# Altium project galil-router-hw.PrjPCB
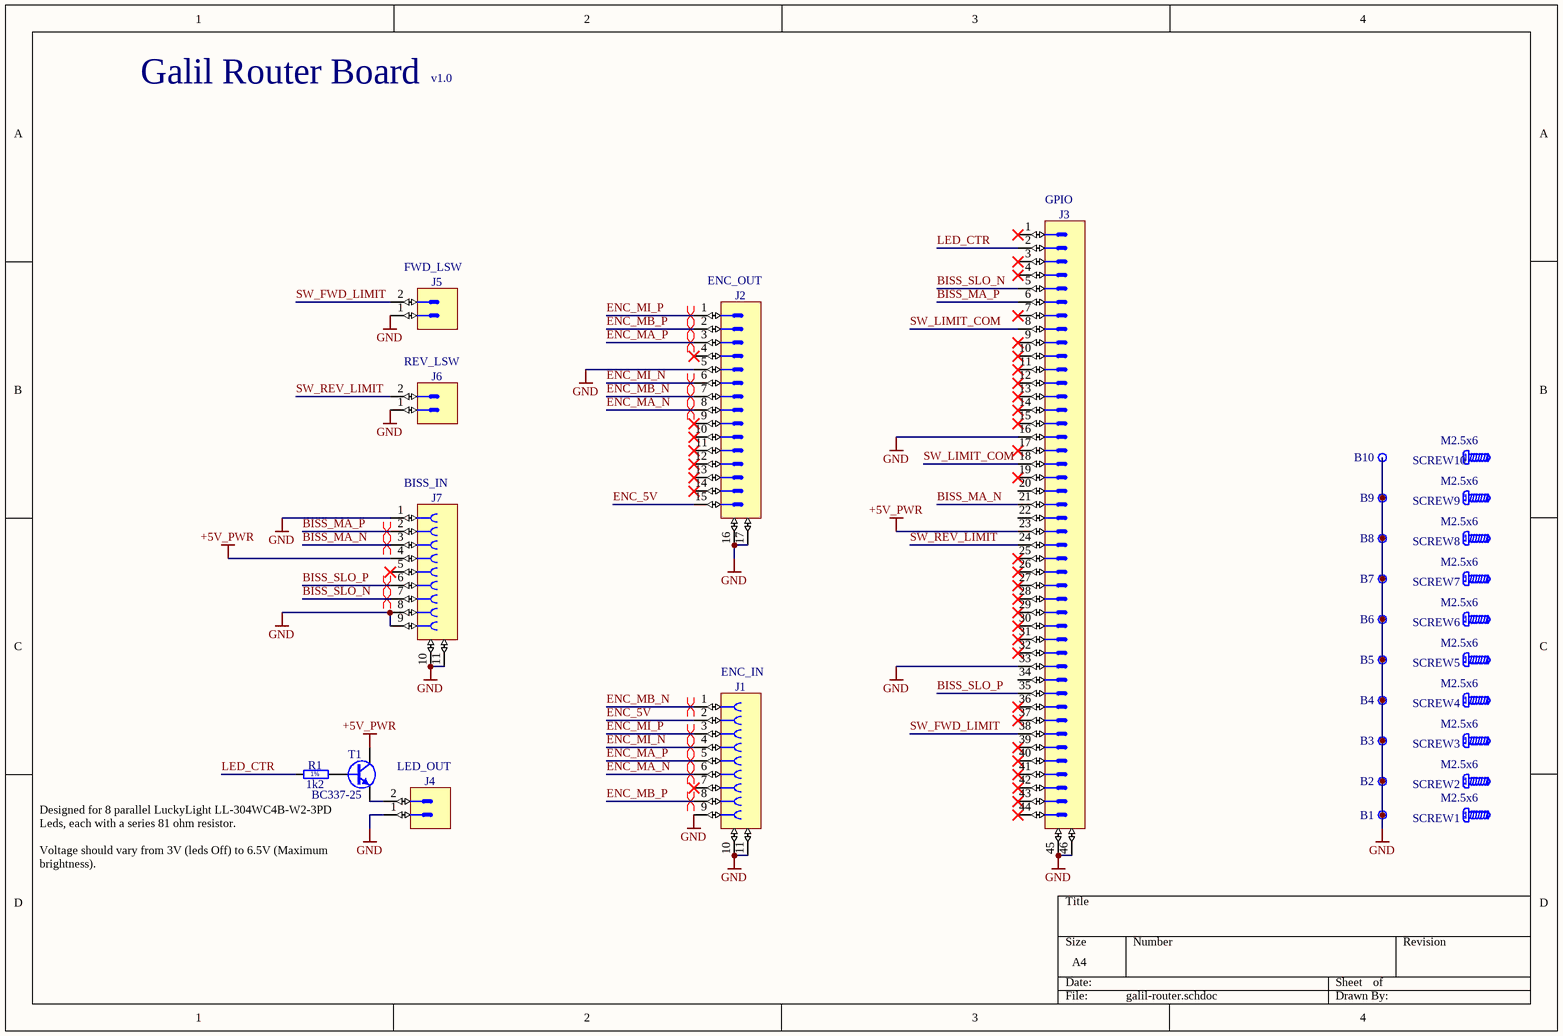
[diagram p0: galil-router.schdoc]
1 sheet, 29 parts. Net scope: global (net labels, ports and power ports of the same name join across sheets).
Board file: galil-router.PcbDoc

## Sheet galil-router.schdoc
size A4

### Parts
B1  Plated Hole  [MTG270_500]  (value not drawn)
B2  Plated Hole  [MTG270_500]  (value not drawn)
B3  Plated Hole  [MTG270_500]  (value not drawn)
B4  Plated Hole  [MTG270_500]  (value not drawn)
B5  Plated Hole  [MTG270_500]  (value not drawn)
B6  Plated Hole  [MTG270_500]  (value not drawn)
B7  Plated Hole  [MTG270_500]  (value not drawn)
B8  Plated Hole  [MTG270_500]  (value not drawn)
B9  Plated Hole  [MTG270_500]  (value not drawn)
B10  Plated Hole  [MTG270_500]  (value not drawn)
J1  D-Sub  [AMPHENOL_LD09S24A4GV00LF]  (value not drawn)
J2  D-Sub  [AMPHENOL_10090928-P154VLF]  (value not drawn)
J3  D-Sub 44M  [HARTING_09 56 361 5713]  (value not drawn)
J4  Micro-Fit 3.0™  [MOLEX_43650-0228]  (value not drawn)
J5  Micro-Fit 3.0™  [MOLEX_43650-0228]  (value not drawn)
J6  Micro-Fit 3.0™  [MOLEX_43650-0228]  (value not drawn)
J7  D-Sub  [AMPHENOL_LD09S24A4GV00LF]  (value not drawn)
R1  1k2  [RES1016-630X250]
SCREW1  M2.5x6  [BOSSARD_BN5687-3061597_v]
SCREW2  M2.5x6  [BOSSARD_BN5687-3061597_v]
SCREW3  M2.5x6  [BOSSARD_BN5687-3061597_v]
SCREW4  M2.5x6  [BOSSARD_BN5687-3061597_v]
SCREW5  M2.5x6  [BOSSARD_BN5687-3061597_v]
SCREW6  M2.5x6  [BOSSARD_BN5687-3061597_v]
SCREW7  M2.5x6  [BOSSARD_BN5687-3061597_v]
SCREW8  M2.5x6  [BOSSARD_BN5687-3061597_v]
SCREW9  M2.5x6  [BOSSARD_BN5687-3061597_v]
SCREW10  M2.5x6  [BOSSARD_BN5687-3061597_v]
T1  BC337-25  [TO-92AA-P254]

### Nets
+5V_PWR: J3.23 J7.4 T1.1(C)
GND: B1.1 B2.1 B3.1 B4.1 B5.1 B6.1 B7.1 B8.1 B9.1 B10.1 J1.9 J1.10 J1.11 J2.5 J2.16 J2.17 J3.16 J3.33 J3.45 J3.46 J4.1 J5.1 J6.1 J7.1 J7.8 J7.9 J7.10 J7.11
BISS_MA_N: J3.21 J7.3
BISS_MA_P: J3.6 J7.2
BISS_SLO_N: J3.5 J7.7
BISS_SLO_P: J3.35 J7.6
ENC_5V: J1.2 J2.15
ENC_MA_N: J1.6 J2.8
ENC_MA_P: J1.5 J2.3
ENC_MB_N: J1.1 J2.7
ENC_MB_P: J1.8 J2.2
ENC_MI_N: J1.4 J2.6
ENC_MI_P: J1.3 J2.1
LED_CTR: J3.2 R1.1
SW_FWD_LIMIT: J3.38 J5.2
SW_LIMIT_COM: J3.8 J3.18
SW_REV_LIMIT: J3.24 J6.2
NetJ4_2: J4.2 T1.3(E)
NetR1_2: R1.2 T1.2(B)

Not connected (* = marked no-connect by the designer): J1 7*; J2 4* 9* 10* 11* 12* 13* 14*; J3 1* 3* 4* 7* 9* 10* 11* 12* 13* 14* 15* 17* 19* 20 22 25* 26* 27* 28* 29* 30* 31* 32* 34 36* 37* 39* 40* 41* 42* 43* 44*; J7 5*

### Layout directives
differential pair: BISS_MA_N, BISS_MA_P, BISS_SLO_N, BISS_SLO_P, ENC_MA_N, ENC_MA_P, ENC_MB_N, ENC_MB_P, ENC_MI_N, ENC_MI_P

### Notes on the sheet
- Galil Router Board
- v1.0
- (near J3) GPIO
- (near J5) FWD_LSW
- (near J2) ENC_OUT
- REV_LSW
- (near J7) BISS_IN
- (near J1) ENC_IN
- LED_OUT
- Designed for 8 parallel LuckyLight LL-304WC4B-W2-3PD Leds, each with a series 81 ohm resistor.
  Voltage should vary from 3V (leds Off) to 6.5V (Maximum brightness).
- (in symbol RMF_1K2_1%_0.6W_50PPM_1016-630X250) 1%

### Library data of the parts
B1-B10 = PLATED_HOLE2.7_PAD5.0: Single Terminal Socket; Part Description: Plated Through Hole: Hole Dia.=2.7mm Pad Dia.=5.0mm; Mounted: No; Part Number: PLATED_HOLE2.7_PAD5.0; Component Kind: Standard (No BOM); Component Type: Standard (No BOM); Pin Count: 1; Family: Plated Hole; Socket: No; SMD: No; Sense: No; Status: None; ComponentHeight: 0mm; HelpURL: Undefined; Author: CERN DEM JMW; CreateDate: 27/09/2011; LatestRevisionDate: 27/09/2011; PackageDescription: Plated Through Hole: Hole Dia.=2.7mm Pad Dia.=5.0mm
J1 J7 = AMPHENOL_LD09S24A4GV00LF: Connector D-sub 9 Female; Part Description: Straight D-Sub 9 Female Contacts with Rear Insert 4-40 and Boardlock; PressFit: No; Part Number: AMPHENOL_LD09S24A4GV00LF; Component Kind: Standard; Component Type: Standard; Pin Count: 11; Family: D-Sub; Mounted: Yes; Socket: No; SMD: No; Sense: No; Status: None; Manufacturer: AMPHENOL; Manufacturer Part Number: LD09S24A4GV00LF; ComponentHeight: 13mm; Author: LNLS DIG GBMB; CreateDate: 27/07/2018; LatestRevisionDate: 27/07/2018
J2 = AMPHENOL_10090928-P154VLF: Connector D-sub 15 Male; Part Description: Straight D-Sub 15 Male Contacts with Rear Insert 4-40 and Boardlock; PressFit: No; Part Number: AMPHENOL_10090928-P154VLF; Component Kind: Standard; Component Type: Standard; Pin Count: 17; Family: D-Sub; Mounted: Yes; Socket: No; SMD: No; Sense: No; Status: None; Manufacturer: AMPHENOL; Manufacturer Part Number: 10090928-P154VLF; ComponentHeight: 13mm; Author: LNLS DIG GBMB; CreateDate: 30/07/2018; LatestRevisionDate: 30/07/2018
J3 = HARTING_09 56 361 5713: Connector D-sub 50 Male; Part Description: Right Angled D-Sub 50 Male Contacts With Grounding Board Locks And  UNC40 Screwlock; PressFit: No; Part Number: HARTING_09 56 361 5713; Component Kind: Standard; Component Type: Standard; Pin Count: 46; Family: D-Sub 44M; Mounted: Yes; Socket: No; SMD: No; Sense: No; Status: None; Manufacturer: HARTING; Manufacturer Part Number: 09 56 361 5713; ComponentHeight: 13mm; Author: LNLS DIG GBMB; CreateDate: 31/07/2018; LatestRevisionDate: 31/07/2018
J4-J6 = MOLEX_43650-0228: Connector 2 Male; Part Description: 3.00mm (.118") Pitch Micro-Fit 3.0™ Header, Single Row, Vertical, with PCB Polarizing Peg, 2 Circuits; Manufacturer: MOLEX; PressFit: No; Part Number: MOLEX_43650-0228; Component Kind: Standard; Component Type: Standard; Pin Count: 2; Family: Micro-Fit 3.0™; Mounted: Yes; Socket: No; SMD: No; Sense: No; Status: None; Manufacturer Part Number: 43650-0228; ComponentHeight: 9.91mm; Author: LNLS DIG GBMB; CreateDate: 31/07/2018; LatestRevisionDate: 31/07/2018
R1 = RMF_1K2_1%_0.6W_50PPM_1016-630X250: Resistor - 1%; Part Description: Leaded Metal Film Resistor; Manufacturer: GENERIC; Manufacturer1 Part Number: MBB02070C1201FCT00; Power: 0.6W; TC: ±50ppm/°C; Part Number: RMF_1K2_1%_0.6W_50PPM_1016-630X250; Component Kind: Standard; Component Type: Standard; Pin Count: 2; Value: 1k2; Status: Preferred; Tolerance: ±1%; Manufacturer Part Number: RMF_1K2_1%_0.6W_50PPM_1016-630X250; Case: LS10.16 L6.3 x D2.5; Mounted: Yes; Sense: No; Socket: No; SMD: No; ComponentHeight: 2.5mm; Manufacturer1 Example: VISHAY BEYSCHLAG; Manufacturer1 ComponentHeight: 2.5mm; HelpURL: \\cern.ch\dfs\Applications\Altium\Datasheets\RMF_VISHAY_MBB0207.pdf; Author: CERN DEM JLC; CreateDate: 04/12/2007; LatestRevisionDate: 07/04/2008
SCREW1-SCREW10 = BOSSARD_BN5687-3061597_v: Screw; Part Description: M2.5 L=6mm Hexalobular Socket Pan Head Screw, Fully Threaded, Stainless Steel A2; Manufacturer Part Number: BN5687 Art.3061597; PressFit: No; Part Number: BOSSARD_BN5687-3061597_v; Component Kind: Standard; Component Type: Mechanical; Pin Count: 0; PackageDescription: M2.5 L=6mm Hexalobular Socket Pan Head Screw, Fully Threaded - Stainless Steel A2; Mounted: Yes; Socket: No; SMD: No; Sense: No; Status: None; Value: M2.5x6; Manufacturer: BOSSARD; ComponentHeight: 2.1mm; HelpURL: \\cern.ch\dfs\Applications\Altium\Datasheets\BOSSARD_BN5687-3061597.pdf; Author: CERN DEM JLC; CreateDate: 30/05/2013; LatestRevisionDate: 30/05/2013
T1 = BC337-25: NPN Transistor; Part Description: 45V 500mA NPN General-Purpose Transistor; Manufacturer: NXP SEMICONDUCTORS; PressFit: No; Bonding: No; Part Number: BC337-25; Component Kind: Standard; Component Type: Standard; Device: BC337-25; PackageDescription: TO-92 (TO226), Pitch 2.54mm, Flat Index, 3 In-Line, Bent Leads, Body Dia. 5.3mm; Status: Obsolete; Manufacturer Part Number: BC337-25; Pin Count: 3; Case: TO-92; Mounted: Yes; Socket: No; SMD: No; Sense: No; ComponentHeight: 7.7mm; HelpURL: \\cern.ch\dfs\Applications\Altium\Datasheets\BC337-25.pdf; Author: CERN DEM JLC; CreateDate: 21/02/2008; LatestRevisionDate: 27/08/2014